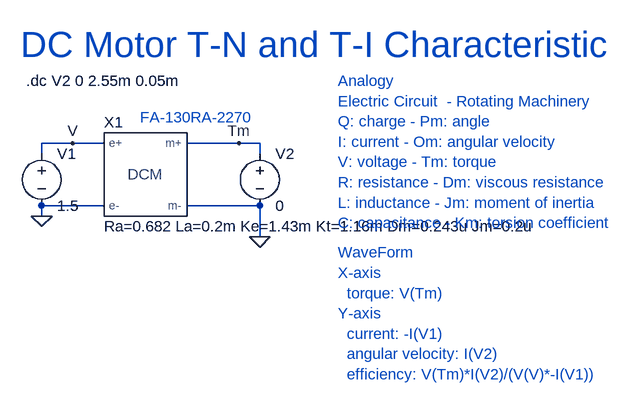
[diagram p0: schematic DCMotorTNandTICharacteristic.asc]
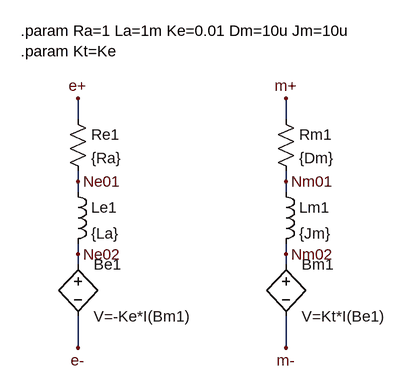
[diagram p1: sub-circuit dcmotorinternalmodel.asc]
DCMotorTNandTICharacteristic.asc, the LTspice schematic file:
Version 4
SHEET 1 1108 680
WIRE 112 128 64 128
WIRE 160 128 112 128
WIRE 368 128 288 128
WIRE 400 128 368 128
WIRE 64 144 64 128
WIRE 400 144 400 128
WIRE 160 224 64 224
WIRE 400 224 288 224
WIRE 64 240 64 224
WIRE 400 272 400 224
FLAG 64 240 0
FLAG 400 272 0
FLAG 112 128 V
FLAG 368 128 Tm
SYMBOL voltage 64 128 R0
WINDOW 123 0 0 Left 2
WINDOW 39 0 0 Left 2
SYMATTR InstName V1
SYMATTR Value 1.5
SYMBOL voltage 400 128 R0
WINDOW 123 0 0 Left 2
WINDOW 39 0 0 Left 2
SYMATTR InstName V2
SYMATTR Value 0
SYMBOL DCMotorInternalModel 288 176 R0
SYMATTR InstName X1
SYMATTR SpiceLine Ra=0.682 La=0.2m Ke=1.43m Kt=1.16m Dm=0.243u Jm=0.2u
TEXT 40 32 Left 2 !.dc V2 0 2.55m 0.05m
TEXT 520 32 Left 2 ;Analogy\nElectric Circuit  - Rotating Machinery\nQ: charge - Pm: angle\nI: current - Om: angular velocity\nV: voltage - Tm: torque\nR: resistance - Dm: viscous resistance\nL: inductance - Jm: moment of inertia\nC: capacitance - Km: torsion coefficient
TEXT 216 88 Left 2 ;FA-130RA-2270
TEXT 32 -24 Left 5 ;DC Motor T-N and T-I Characteristic
TEXT 520 296 Left 2 ;WaveForm\nX-axis\n  torque: V(Tm)\nY-axis\n  current: -I(V1)\n  angular velocity: I(V2)\n  efficiency: V(Tm)*I(V2)/(V(V)*-I(V1))

dcmotorinternalmodel.asc, the sub-circuit schematic file:
Version 4
SHEET 1 1092 680
WIRE 320 -64 320 -96
WIRE 640 -64 640 -96
WIRE 320 32 320 16
WIRE 640 32 640 16
WIRE 320 48 320 32
WIRE 640 48 640 32
WIRE 320 144 320 128
WIRE 640 144 640 128
WIRE 320 160 320 144
WIRE 640 160 640 144
WIRE 320 288 320 240
WIRE 640 288 640 240
FLAG 320 -96 e+
FLAG 320 288 e-
FLAG 640 -96 m+
FLAG 640 288 m-
FLAG 320 32 Ne01
FLAG 320 144 Ne02
FLAG 640 32 Nm01
FLAG 640 144 Nm02
SYMBOL res 304 -80 R0
SYMATTR InstName Re1
SYMATTR Value {Ra}
SYMBOL ind 304 32 R0
SYMATTR InstName Le1
SYMATTR Value {La}
SYMATTR SpiceLine Rser=0
SYMBOL bv 320 144 R0
SYMATTR InstName Be1
SYMATTR Value V=-Ke*I(Bm1)
SYMBOL res 624 -80 R0
SYMATTR InstName Rm1
SYMATTR Value {Dm}
SYMBOL ind 624 32 R0
SYMATTR InstName Lm1
SYMATTR Value {Jm}
SYMATTR SpiceLine Rser=0
SYMBOL bv 640 144 R0
SYMATTR InstName Bm1
SYMATTR Value V=Kt*I(Be1)
TEXT 232 -200 Left 2 !.param Ra=1 La=1m Ke=0.01 Dm=10u Jm=10u\n.param Kt=Ke

The netlist it stands for:
* DCMotorTNandTICharacteristic.asc
V1 V 0 1.5
V2 Tm 0 0
XX1 V 0 Tm 0 dcmotorinternalmodel params: Ra=0.682 La=0.2m Ke=1.43m Kt=1.16m Dm=0.243u Jm=0.2u

* block symbol definitions
.subckt dcmotorinternalmodel e+ e- m+ m-
Re1 e+ Ne01 {Ra}
Le1 Ne01 Ne02 {La} Rser=0
Be1 Ne02 e- V=-Ke*I(Bm1)
Rm1 m+ Nm01 {Dm}
Lm1 Nm01 Nm02 {Jm} Rser=0
Bm1 Nm02 m- V=Kt*I(Be1)
.param Ra=1 La=1m Ke=0.01 Dm=10u Jm=10u
.param Kt=Ke
.ends dcmotorinternalmodel

.dc V2 0 2.55m 0.05m
* Analogy
* Electric Circuit  - Rotating Machinery
* Q: charge - Pm: angle
* I: current - Om: angular velocity
* V: voltage - Tm: torque
* R: resistance - Dm: viscous resistance
* L: inductance - Jm: moment of inertia
* C: capacitance - Km: torsion coefficient
* FA-130RA-2270
* DC Motor T-N and T-I Characteristic
* WaveForm
* X-axis
*   torque: V(Tm)
* Y-axis
*   current: -I(V1)
*   angular velocity: I(V2)
*   efficiency: V(Tm)*I(V2)/(V(V)*-I(V1))
.backanno
.end